# Altium project hot_air.PrjPcb
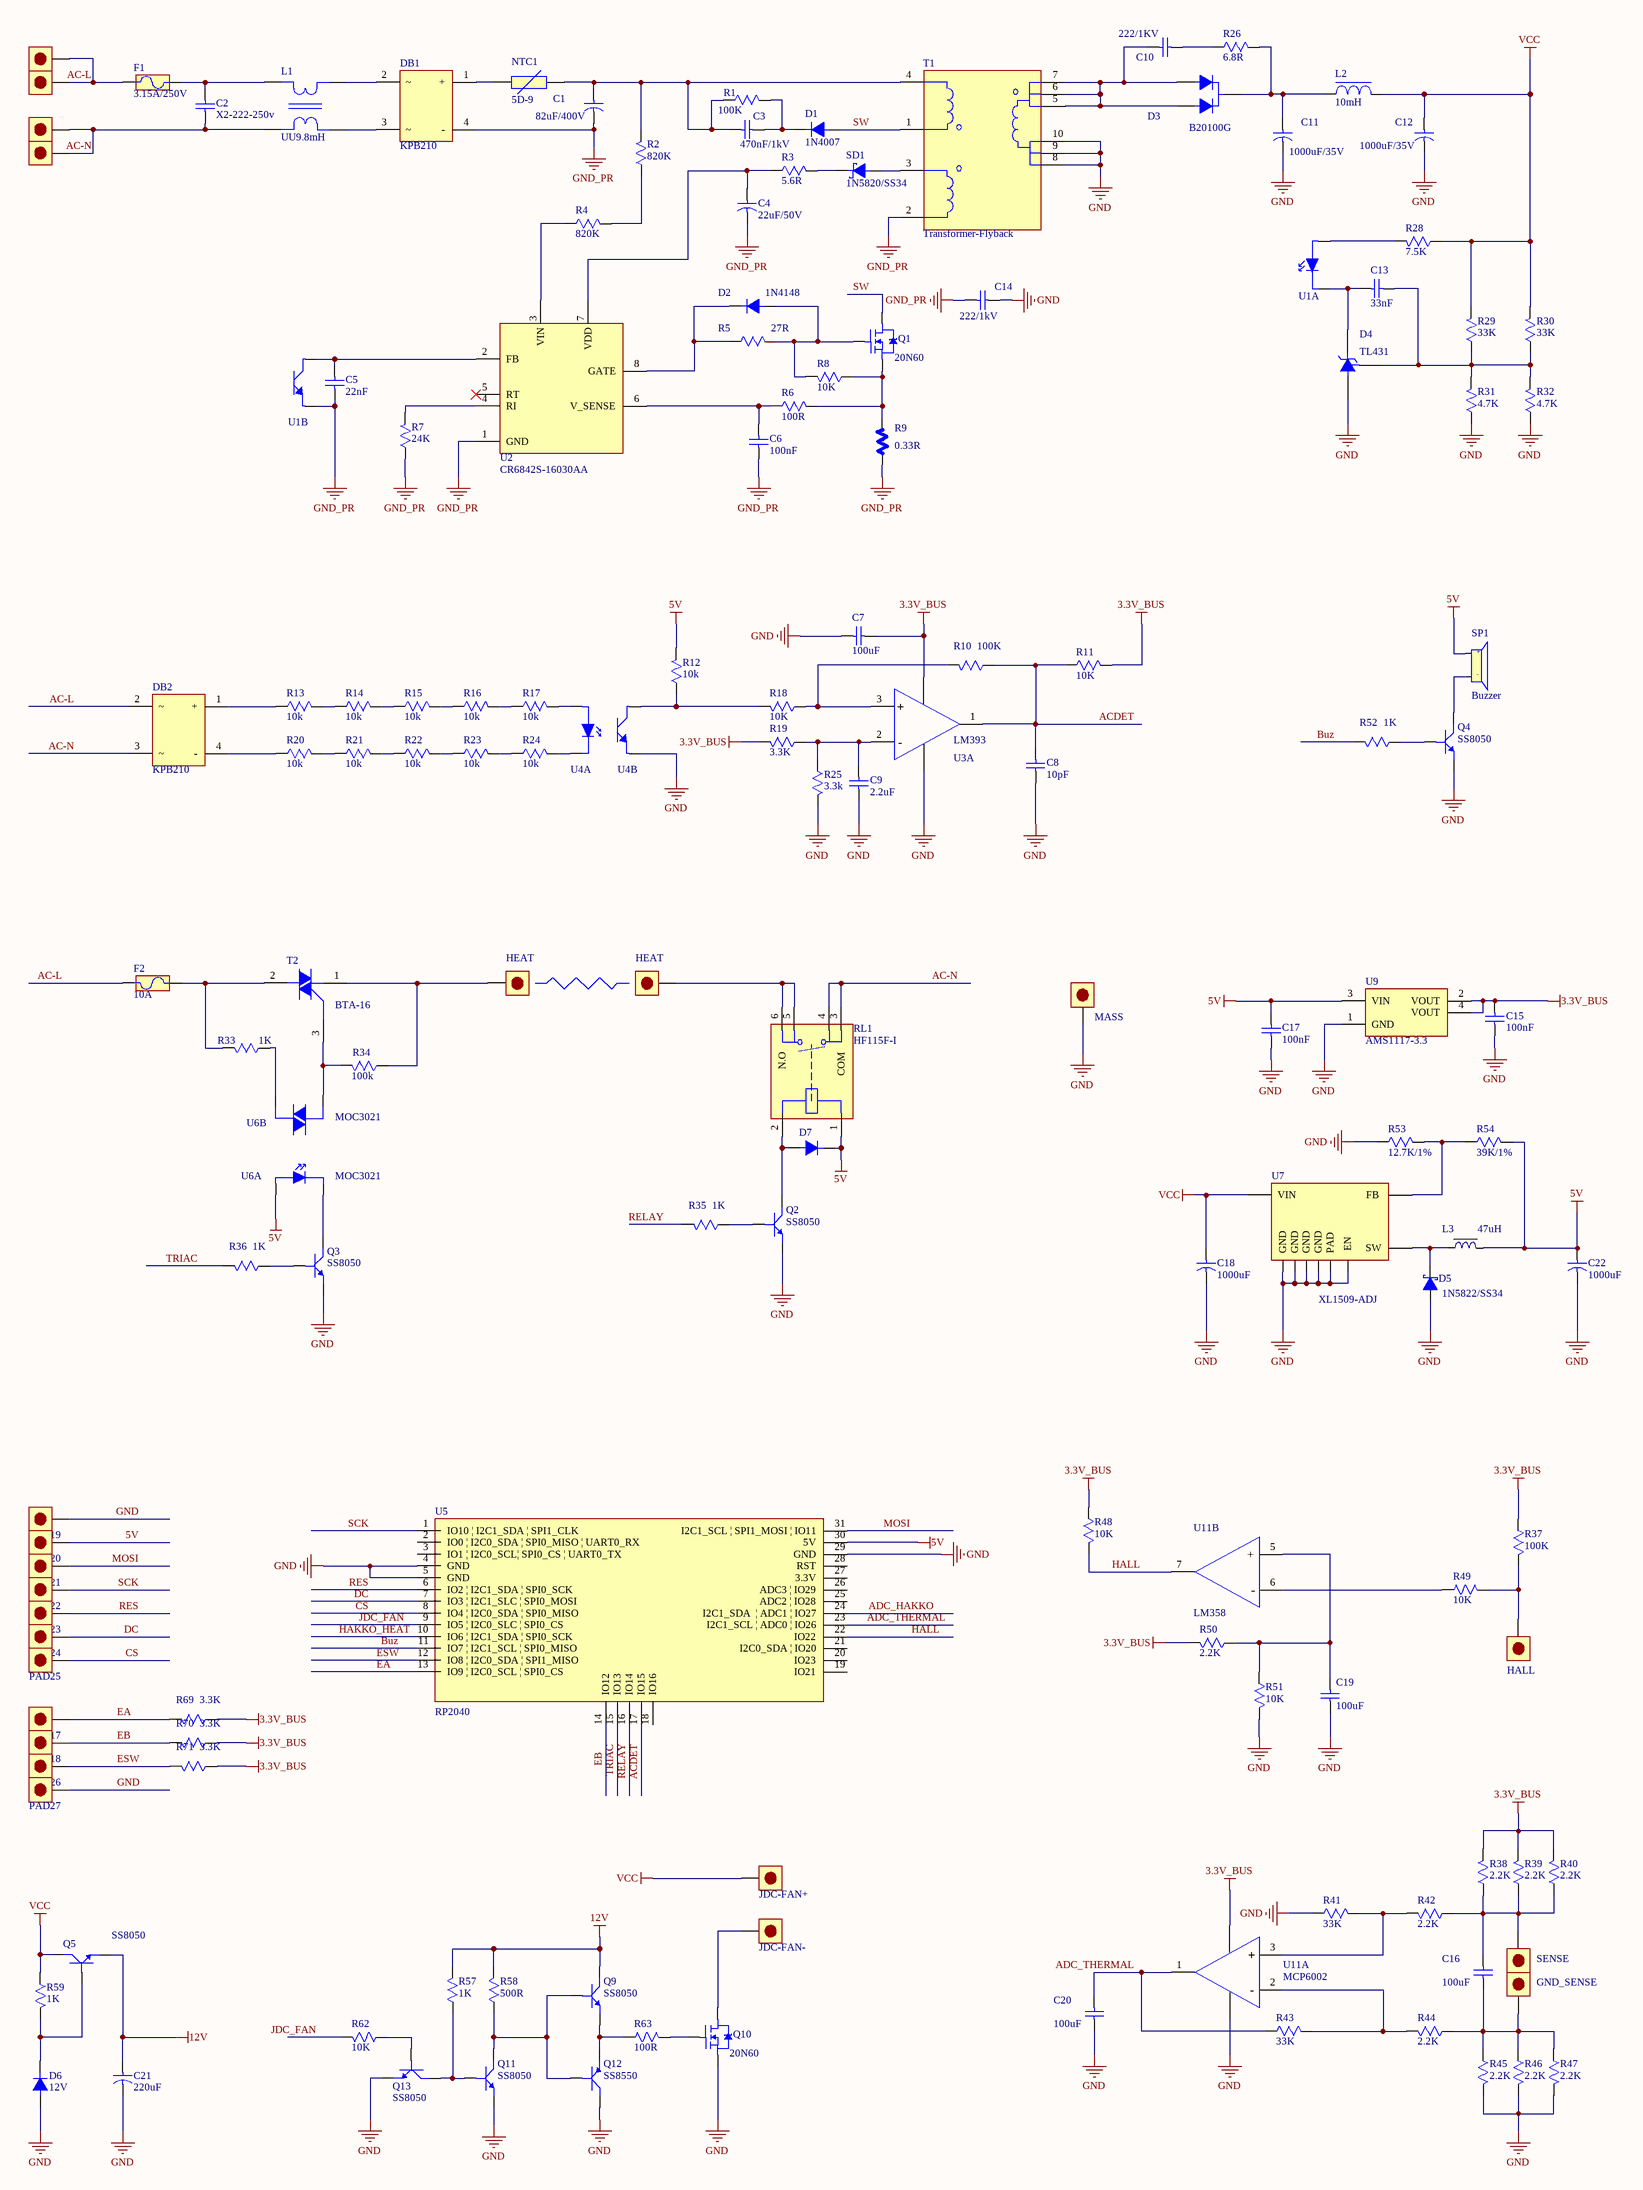
[diagram p0: hot_air.SchDoc]
2 sheets, 167 parts. Net scope: global (net labels, ports and power ports of the same name join across sheets).
Board file: JDC-858D+HAKKO907.~(178).PcbDoc
Sheets:
  hot_air.SchDoc
  quick-907.SchDoc

## Sheet hot_air.SchDoc
size 381 x 508 mm; SheetNumber: 1; SheetTotal: 2

### Parts
C1  82uF/400V  [CAP-TH-16MM]
C2  X2-222-250v  [CAPACITOR-X2_10MM]
C3  470nF/1kV  [CAP-HV]
C4  22uF/50V  [CAP-TH-6.3MM]
C5  22nF  [C0805]
C6  100nF  [C0805]
C7  100uF  [C0805]
C8  10pF  [C0805]
C9  2.2uF  [C0805]
C10  222/1KV  [CAP-HV]
C11  1000uF/35V  [CAP-TH-10MM]
C12  1000uF/35V  [CAP-TH-10MM]
C13  33nF  [C0805]
C14  222/1kV  [CAP-HV]
C15  100nF  [C0805]
C16  100uF  [C0805]
C17  100nF  [C1206]
C18  1000uF  [CAP-TH-8MM]
C19  100uF  [C0805]
C20  100uF  [C0805]
C21  220uF  [CAP-TH-10MM]
C22  1000uF  [CAP-TH-8MM]
D1  1N4007  [DIODE/POW/1A]
D2  1N4148  [LL-34(MiniMELF)]
D3  B20100G  [TO-220]
D4  TL431  [SOT-23]
D5  1N5822/SS34  [DO-214AC(SMA)]
D6  12V  [DO-41_V]
D7  (no value)  [SOD-123F]
DB1  KPB210  [KBP210]
DB2  KPB210  [ABS210]
F1  3.15A/250V  [FUSE-3.15A-250V]
F2  10A  [FUSE-TH-5*20]
L1  UU9.8mH  [UU9.8-7X8MM]
L2  10mH  [INDUCTOR-TH-8mm]
L3  47uH  [L-SMD-06030-7.4x6.6X3]
NTC1  5D-9  [XD-13]
PAD1  Pad_Through_Hole  [THROUGH_HOLE_MEDIUM]  (value not drawn)
PAD2  Pad_Through_Hole  [THROUGH_HOLE_MEDIUM]  (value not drawn)
PAD3  Pad_Through_Hole  [THROUGH_HOLE_MEDIUM]  (value not drawn)
PAD4  Pad_Through_Hole  [THROUGH_HOLE_MEDIUM]  (value not drawn)
PAD5  HEAT  [THROUGH_HOLE_MEDIUM]
PAD6  HEAT  [THROUGH_HOLE_MEDIUM]
PAD7  MASS  [THROUGH_HOLE_MEDIUM]
PAD10  HALL  [THROUGH_HOLE_MEDIUM]
PAD11  GND_SENSE  [THROUGH_HOLE_MEDIUM]
PAD12  SENSE  [THROUGH_HOLE_MEDIUM]
PAD13  JDC-FAN+  [THROUGH_HOLE_MEDIUM]
PAD14  JDC-FAN-  [THROUGH_HOLE_MEDIUM]
PAD17  Pad_Through_Hole  [THROUGH_HOLE_SMALL]  (value not drawn)
PAD18  Pad_Through_Hole  [THROUGH_HOLE_SMALL]  (value not drawn)
PAD19  Pad_Through_Hole  [THROUGH_HOLE_SMALL]  (value not drawn)
PAD20  Pad_Through_Hole  [THROUGH_HOLE_SMALL]  (value not drawn)
PAD21  Pad_Through_Hole  [THROUGH_HOLE_SMALL]  (value not drawn)
PAD22  Pad_Through_Hole  [THROUGH_HOLE_SMALL]  (value not drawn)
PAD23  Pad_Through_Hole  [THROUGH_HOLE_SMALL]  (value not drawn)
PAD24  Pad_Through_Hole  [THROUGH_HOLE_SMALL]  (value not drawn)
PAD25  Pad_Through_Hole  [THROUGH_HOLE_SMALL]  (value not drawn)
PAD26  Pad_Through_Hole  [THROUGH_HOLE_SMALL]  (value not drawn)
PAD27  Pad_Through_Hole  [THROUGH_HOLE_SMALL]  (value not drawn)
Q1  20N60  [TO-220]
Q2  SS8050  [SOT-23]
Q3  SS8050  [SOT-23]
Q4  SS8050  [SOT-23]
Q5  SS8050  [SOT-23]
Q9  SS8050  [SOT-23]
Q10  20N60  [TO-252-2]
Q11  SS8050  [SOT-23]
Q12  SS8550  [SOT-23]
Q13  SS8050  [SOT-23]
R1  100K  [R2512]
R2  820K  [R0805]
R3  5.6R  [R0805]
R4  820K  [R0805]
R5  27R  [R0805]
R6  100R  [R0805]
R7  24K  [R0805]
R8  10K  [R0805]
R9  0.33R  [R2512]
R10  100K  [R0805]
R11  10K  [R0805]
R12  10k  [R0805]
R13  10k  [R0805]
R14  10k  [R0805]
R15  10k  [R0805]
R16  10k  [R0805]
R17  10k  [R0805]
R18  10K  [R0805]
R19  3.3K  [R0805]
R20  10k  [R0805]
R21  10k  [R0805]
R22  10k  [R0805]
R23  10k  [R0805]
R24  10k  [R0805]
R25  3.3k  [R0805]
R26  6.8R  [R0805]
R28  7.5K  [R0805]
R29  33K  [R0805]
R30  33K  [R0805]
R31  4.7K  [R0805]
R32  4.7K  [R0805]
R33  1K  [R2512]
R34  100k  [R0805]
R35  1K  [R0805]
R36  1K  [R0805]
R37  100K  [R0805]
R38  2.2K  [R0805]
R39  2.2K  [R0805]
R40  2.2K  [R0805]
R41  33K  [R0805]
R42  2.2K  [R0805]
R43  33K  [R0805]
R44  2.2K  [R0805]
R45  2.2K  [R0805]
R46  2.2K  [R0805]
R47  2.2K  [R0805]
R48  10K  [R0805]
R49  10K  [R0805]
R50  2.2K  [R0805]
R51  10K  [R0805]
R52  1K  [R0805]
R53  12.7K/1%  [R0603]
R54  39K/1%  [R0603]
R57  1K  [R0805]
R58  500R  [R0805]
R59  1K  [R0805]
R62  10K  [R0805]
R63  100R  [R0805]
R69  3.3K  [R0805]
R70  3.3K  [R0805]
R71  3.3K  [R0805]
RL1  HF115F-I  [HF115F-I]
SD1  1N5820/SS34  [DO-214AC(SMA)]
SP1  Buzzer  [Buzzer]
T1  Transformer-Flyback  [EE.27]
T2  BTA-16  [TO-220]
U1  PC817  [SMD-4]  (value not drawn)  (parts A,B of 2)
U2  CR6842S-16030AA  [SOP-8]
U3  LM393  [SOP-8]  (part A of 2)
U4  PC817  [PC817]  (value not drawn)  (parts A,B of 2)
U5  RP2040  [RP2040-MICROPRO]
U6  MOC3021  [DIP-6]  (parts A,B of 2)
U7  XL1509-ADJ  [SOP-8-PAD]
U9  AMS1117-3.3  [SOT223]
U11  MCP6002  [DIP-8]  (parts A,B of 2)

### Nets
3.3V_BUS: C7.1 C15.2 R11.2 R19.2 R37.2 R38.2 R39.2 R40.2 R48.2 R50.2 R69.1 R70.1 R71.1 U3.8 U9.2(VOUT) U9.4(VOUT) U11.8
5V: C17.2 C22.1 D7.2(K) L3.2 PAD20.1 R12.2 R54.2 RL1.1 SP1.1 U5.30(5V) U6.1(A) U9.3(VIN)
12V: C21.1 Q5.2(E) Q9.3(C) R57.1 R58.1
GND: C7.2 C8.1 C9.2 C11.2 C12.2 C14.2 C15.1 C17.1 C18.2 C19.2 C20.2 C21.2 C22.2 D4.3(K) D5.A D6.1(A) PAD7.1 PAD19.1 PAD27.1 Q2.2(E) Q3.2(E) Q4.2(E) Q10.3(S) Q11.2(E) Q12.3(C) Q13.2(E) R25.2 R31.1 R32.1 R41.1 R45.2 R46.2 R47.2 R51.1 R53.1 T1.8 T1.9 T1.10 U3.4 U4.3(E) U5.4(GND) U5.5(GND) U5.29(GND) U7.4(EN) U7.5(GND) U7.6(GND) U7.7(GND) U7.8(GND) U7.9(PAD) U9.1(GND) U11.4
GND_PR: C1.2 C4.2 C5.1 C6.1 C14.1 DB1.4(-) R7.1 R9.1 T1.2 U1.3(E) U2.1(GND)
VCC: C12.1 C18.1 L2.2 PAD13.1 Q5.3(C) R28.1 R29.2 R30.2 R59.1 U7.1(VIN)
AC-L: DB2.2 F1.1 F2.1 PAD3.1 PAD4.1
AC-N: C2.2 DB2.3 L1.4 PAD1.1 PAD2.1 RL1.3(COM) RL1.4
ACDET: C8.2 R10.1 R11.1 U3.1 U5.17(IO15)
ADC_HAKKO: U5.24(I2C1_SDA__|_ADC1_|_IO27)
ADC_THERMAL: C20.1 R43.1 U5.23(I2C1_SCL_|_ADC0_|_IO26) U11.1
Buz: R52.2 U5.11(IO7_|_I2C1_SCL_|_SPI0_MISO)
CS: PAD25.1 U5.8(IO4_|_I2C0_SDA_|_SPI0_MISO)
DC: PAD24.1 U5.7(IO3_|_I2C1_SLC_|_SPI0_MOSI)
EA: PAD17.1 R69.2 U5.13(IO9_|_I2C0_SCL_|_SPI0_CS)
EB: PAD18.1 R70.2 U5.14(IO12)
ESW: PAD26.1 R71.2 U5.12(IO8_|_I2C0_SDA_|_SPI1_MISO)
HAKKO_HEAT: U5.10(IO6_|_I2C1_SDA_|_SPI0_SCK)
HALL: R48.1 U5.22(IO22) U11.7
JDC_FAN: R62.1 U5.9(IO5_|_I2C0_SLC_|_SPI0_CS)
MOSI: PAD21.1 U5.31(I2C1_SCL_|_SPI1_MOSI_|_IO11)
RELAY: R35.2 U5.16(IO14)
RES: PAD23.1 U5.6(IO2_|_I2C1_SDA_|_SPI0_SCK)
SCK: PAD22.1 U5.1(IO10_|_I2C1_SDA_|_SPI1_CLK)
SW: D1.1(A) Q1.2(D) T1.1
TRIAC: R36.2 U5.15(IO13)
NetC1_1: C1.1 C3.2 NTC1.2 R1.1 R2.2 T1.4
NetC2_1: C2.1 F1.2 L1.1
NetC3_1: C3.1 D1.2(K) R1.2
NetC4_1: C4.1 R3.1 U2.7(VDD)
NetC5_2: C5.2 U1.4(C) U2.2(FB)
NetC6_2: C6.2 R6.1 U2.6(V_SENSE)
NetC9_1: C9.1 R19.1 R25.1 U3.2(-)
NetC10_1: C10.1 D3.1(A) D3.3(A) T1.5 T1.6 T1.7
NetC10_2: C10.2 R26.1
NetC11_1: C11.1 D3.2(K) L2.1 R26.2
NetC13_1: C13.1 D4.1(A) R29.1 R30.1 R31.2 R32.2
NetC13_2: C13.2 D4.2(K) U1.2(K)
NetC16_1: C16.1 PAD12.1 R38.1 R39.1 R40.1 R42.1
NetC16_2: C16.2 PAD11.1 R44.1 R45.1 R46.1 R47.1
NetC19_1: C19.1 R50.1 R51.2 U11.5(+)
NetD2_1: D2.1(A) Q1.1(G) R5.2 R8.2
NetD2_2: D2.2(K) R5.1 U2.8(GATE)
NetD5_K: D5.K L3.1 U7.2(SW)
NetD6_2: D6.2(K) Q5.1(B) R59.2
NetD7_1: D7.1(A) Q2.3(C) RL1.2
NetDB1_1: DB1.1(+) NTC1.1
NetDB1_2: DB1.2 L1.2
NetDB1_3: DB1.3 L1.3
NetDB2_1: DB2.1(+) R13.1
NetDB2_4: DB2.4(-) R20.1
NetF2_2: F2.2 R33.2 T2.2(A)
NetPAD5_1: PAD5.1 RL1.5 RL1.6(N.O)
NetPAD6_1: PAD6.1 R34.1 T2.1(A)
NetPAD10_1: PAD10.1 R37.1 R49.1
NetPAD14_1: PAD14.1 Q10.2(D)
NetQ1_3: Q1.3(S) R6.2 R8.1 R9.2
NetQ2_1: Q2.1(B) R35.1
NetQ3_1: Q3.1(B) R36.1
NetQ3_3: Q3.3(C) U6.2(K)
NetQ4_1: Q4.1(B) R52.1
NetQ4_3: Q4.3(C) SP1.2
NetQ9_1: Q9.1(B) Q11.3(C) Q12.1(B) R58.2
NetQ9_2: Q9.2(E) Q12.2(E) R63.2
NetQ10_1: Q10.1(G) R63.1
NetQ11_1: Q11.1(B) Q13.3(C) R57.2
NetQ13_1: Q13.1(B) R62.2
NetR2_1: R2.1 R4.2
NetR3_2: R3.2 SD1.2(K)
NetR4_1: R4.1 U2.3(VIN)
NetR7_2: R7.2 U2.4(RI)
NetR10_2: R10.2 R18.1 U3.3(+)
NetR12_1: R12.1 R18.2 U4.4(C)
NetR13_2: R13.2 R14.1
NetR14_2: R14.2 R15.1
NetR15_2: R15.2 R16.1
NetR16_2: R16.2 R17.1
NetR17_2: R17.2 U4.1(A)
NetR20_2: R20.2 R21.1
NetR21_2: R21.2 R22.1
NetR22_2: R22.2 R23.1
NetR23_2: R23.2 R24.1
NetR24_2: R24.2 U4.2(K)
NetR28_2: R28.2 U1.1(A)
NetR33_1: R33.1 U6.6
NetR34_2: R34.2 T2.3(A) U6.4
NetR41_2: R41.2 R42.2 U11.3(+)
NetR43_2: R43.2 R44.2 U11.2(-)
NetR49_2: R49.2 U11.6(-)
NetR53_2: R53.2 R54.1 U7.3(FB)
NetSD1_1: SD1.1(A) T1.3

Not connected (* = marked no-connect by the designer): U2 5(RT)*; U5 2(IO0_|_I2C0_SDA_|_SPI0_MISO_|_UART0_RX_) 3(IO1_|_I2C0_SCL|_SPI0_CS_|_UART0_TX_) 18(IO16) 19(IO21) 20(IO23) 21(I2C0_SDA_|_IO20) 25(ADC2_|_IO28) 26(ADC3_|_IO29) 27(3.3V) 28(RST)

### Notes on the sheet
- (in symbol Buzzer_5V) +; -

### Library data of the parts
C1 C4 C11 C12 C18 C21 C22 = Capacitor_polar
C2 C3 C5-C10 C13-C17 C19 C20 = Capacitor_non-polar
D1 D2 D6 D7 = Diode
D3 = Diode-HC
D5 = Diode  Schottky: pin to pad: A>1 K>2; Value: 1N4007
DB1 DB2 = H-Bridge
F1 F2 = FUSE
L1 = Inductor-AC
L2 = Inductor
L3 = inductor-SMD: Value: 150 mH
NTC1 = NTC
PAD5-PAD7 PAD10-PAD14 = Pad_Through_Hole
Q1 Q10 = MOSFET_N-Chanel
Q2-Q5 Q9 Q11 Q13 = Transistor-NPN
Q12 = Transistor-PNP
R1-R8 R10-R26 R28-R52 R57-R59 R62 R63 R69-R71 = Resistor
R9 = Resistor_Shunt
R53 R54 = RES: Manufacturer: Stackpole Electronics; Manufacturer Part Number: RMCF0402FT10K0; Tolerance: 1%; Resistance: 10kR; Power Rating: 63mW; Temperature Coefficient: 100ppm/°C; Voltage Rating: 50V; Supplier 1: Digikey; RoHS: Yes; Category: Chip SMD Resistors; Stock 1: 3729291; Pricing 1: 1=0.1, 10=0.021, 50=0.0116, 100=0.0093, 500=0.00594, 1000=0.005, 5000=0.00345, 10000=0.00299, 20000=0.00261, 30000=0.00242, 50000=0.00221, 100000=0.00196 (USD); Mount: Surface Mount; Case/Package: 0402; Case Code (Metric): 1005; Case Code (Imperial): 0402; Contact Plating: Tin,Matte; Size Code: 0402; Min Operating Temperature: -55°C; Max Operating Temperature: 155°C; Packaging: Tape and Reel; Number of Terminations: 2; Max Power Dissipation: 63mW; Features: Automotive AEC-Q200; Series: RMCF; Construction: Rectangular; Length: 1mm; Width: 0.02inch; Height: 0.016inch; Depth: 0.5mm; Ratings: AEC-Q200; Radiation Hardening: No; Military Standard: Not; Lead Free: Lead Free; RoHS Compliant: Yes; ComponentLink1URL: https://datasheet.ciiva.com/24341/sei-rmcp-24341800.pdf?src-supplier=Onlinecomponents.com; ComponentLink1Description: https://datasheet.ciiva.com/24341/sei-rmcp-24341800.pdf?src-supplier=Onlinecomponents.com
RL1 = Relay-NC
SD1 = Diode_Schottky
SP1 = Buzzer_5V
T2 = Triac
U2 = CR6842S
U3 U11 = Op-Amply/Comparator
U5 = ProMicro RP2040
U6 = Triac-Isolate
U7 = XL1509-BUCK
U9 = AMS1117

## Sheet quick-907.SchDoc
size A4; SheetNumber: 2; SheetTotal: 2
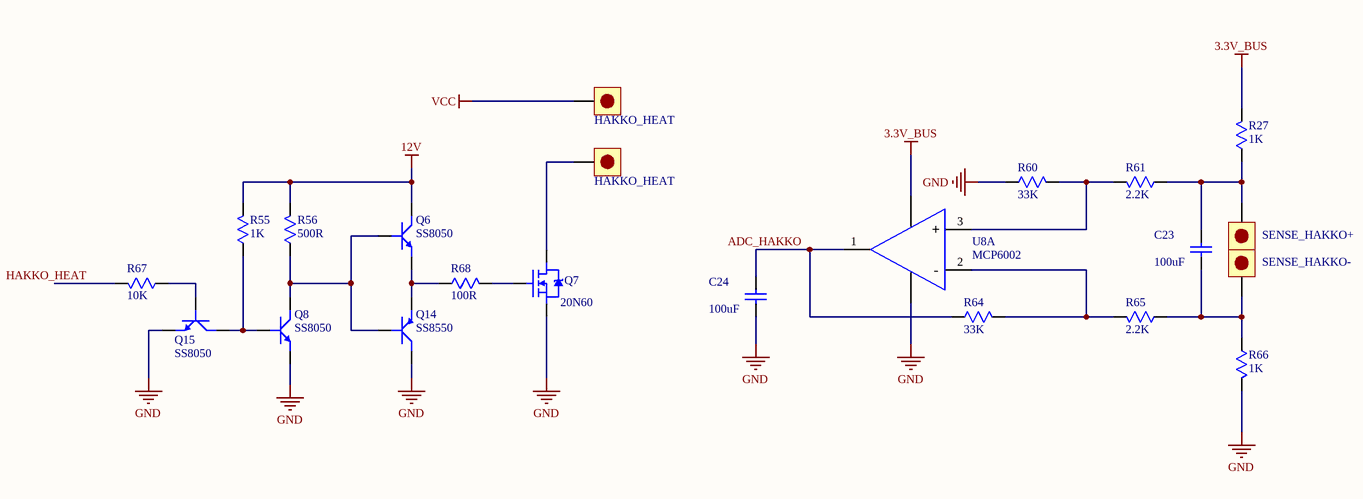
[diagram p1: quick-907.SchDoc]

### Parts
C23  100uF  [C0805]
C24  100uF  [C0805]
PAD8  SENSE_HAKKO-  [THROUGH_HOLE_MEDIUM]
PAD9  SENSE_HAKKO+  [THROUGH_HOLE_MEDIUM]
PAD15  HAKKO_HEAT  [THROUGH_HOLE_MEDIUM]
PAD16  HAKKO_HEAT  [THROUGH_HOLE_MEDIUM]
Q6  SS8050  [SOT-23]
Q7  20N60  [TO-252-2]
Q8  SS8050  [SOT-23]
Q14  SS8550  [SOT-23]
Q15  SS8050  [SOT-23]
R27  1K  [R0805]
R55  1K  [R0805]
R56  500R  [R0805]
R60  33K  [R0805]
R61  2.2K  [R0805]
R64  33K  [R0805]
R65  2.2K  [R0805]
R66  1K  [R0805]
R67  10K  [R0805]
R68  100R  [R0805]
U8  MCP6002  [DIP-8]  (part A of 2)

### Nets
3.3V_BUS: R27.2 U8.8
12V: Q6.3(C) R55.1 R56.1
GND: C24.2 Q7.3(S) Q8.2(E) Q14.3(C) Q15.2(E) R60.1 R66.2 U8.4
VCC: PAD15.1
ADC_HAKKO: C24.1 R64.1 U8.1
HAKKO_HEAT: R67.1
NetC23_1: C23.1 PAD9.1 R27.1 R61.1
NetC23_2: C23.2 PAD8.1 R65.1 R66.1
NetPAD16_1: PAD16.1 Q7.2(D)
NetQ6_1: Q6.1(B) Q8.3(C) Q14.1(B) R56.2
NetQ6_2: Q6.2(E) Q14.2(E) R68.2
NetQ7_1: Q7.1(G) R68.1
NetQ8_1: Q8.1(B) Q15.3(C) R55.2
NetQ15_1: Q15.1(B) R67.2
NetR60_2: R60.2 R61.2 U8.3(+)
NetR64_2: R64.2 R65.2 U8.2(-)

### Library data of the parts
C23 C24 = Capacitor_non-polar
PAD8 PAD9 PAD15 PAD16 = Pad_Through_Hole
Q6 Q8 Q15 = Transistor-NPN
Q7 = MOSFET_N-Chanel
Q14 = Transistor-PNP
R27 R55 R56 R60 R61 R64-R68 = Resistor
U8 = Op-Amply/Comparator

## Nets that join several sheets
3.3V_BUS: hot_air (17 pins), quick-907 (R27.2 U8.8)
12V: hot_air (5 pins), quick-907 (Q6.3 R55.1 R56.1)
GND: hot_air (51 pins), quick-907 (8 pins)
VCC: hot_air (10 pins), quick-907 (PAD15.1)
ADC_HAKKO: hot_air (U5.24), quick-907 (C24.1 R64.1 U8.1)
HAKKO_HEAT: hot_air (U5.10), quick-907 (R67.1)